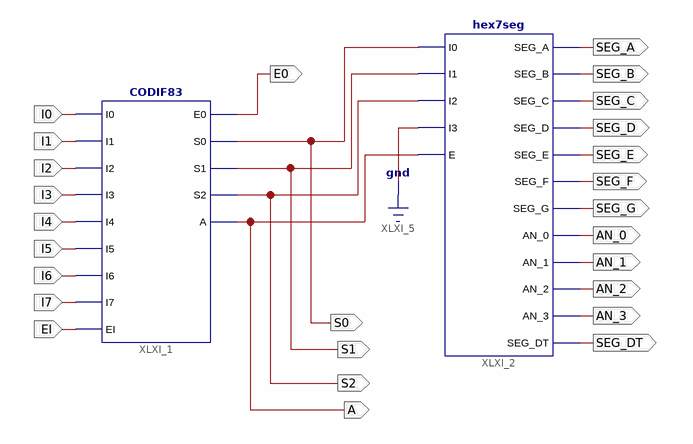
[diagram p0: schematic sheet 1]
// Xilinx ISE schematic CODIF837SEG.sch (spartan3e) as structural Verilog: 2 symbols, 26 ports
module CODIF837SEG (
  input  I0,
  input  I1,
  input  I2,
  input  I3,
  input  I4,
  input  I5,
  input  I6,
  input  I7,
  input  EI,
  output SEG_A,
  output SEG_B,
  output SEG_C,
  output SEG_D,
  output SEG_E,
  output SEG_F,
  output SEG_G,
  output AN_0,
  output AN_1,
  output AN_2,
  output AN_3,
  output SEG_DT,
  output E0,
  output S0,
  output S1,
  output S2,
  output A
);

  CODIF83 XLXI_1 (
    .A(A), .E0(E0), .EI(EI), .I0(I0), .I1(I1), .I2(I2), .I3(I3), .I4(I4), .I5(I5), .I6(I6), .I7(I7), .S0(S0),
    .S1(S1), .S2(S2));
  hex7seg XLXI_2 (
    .AN_0(AN_0), .AN_1(AN_1), .AN_2(AN_2), .AN_3(AN_3), .E(A), .I0(S0), .I1(S1), .I2(S2), .I3(1'b0),
    .SEG_A(SEG_A), .SEG_B(SEG_B), .SEG_C(SEG_C), .SEG_D(SEG_D), .SEG_DT(SEG_DT), .SEG_E(SEG_E),
    .SEG_F(SEG_F), .SEG_G(SEG_G));
endmodule
